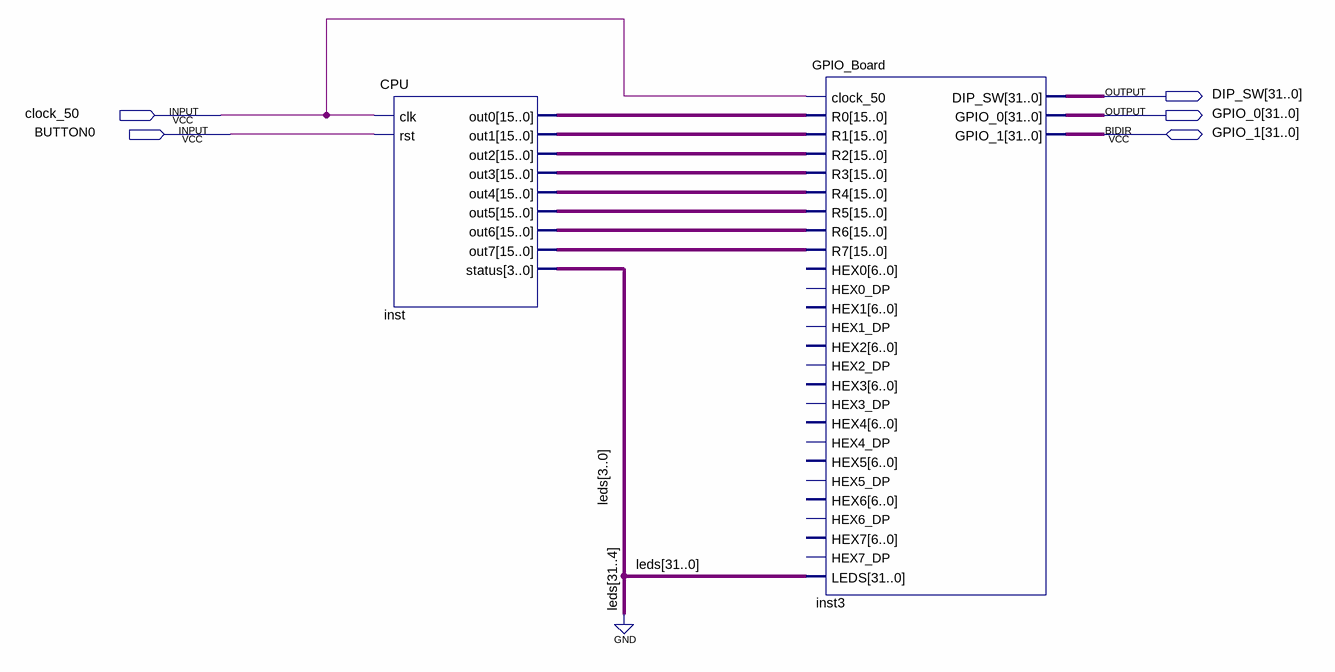
[diagram p0: schematic sheet]
// Quartus schematic NiceBoard.bdf as structural Verilog: 2 symbols, 5 pins
module NiceBoard (
  input  clock_50,
  input  BUTTON0,
  inout  [31:0] GPIO_1,
  output [31:0] DIP_SW,
  output [31:0] GPIO_0
);

  wire [3:0] leds;
  wire [15:0] inst_out0, inst_out1, inst_out2, inst_out3, inst_out4, inst_out5, inst_out6, inst_out7;

  CPU inst (
    .clk(clock_50), .rst(BUTTON0), .out0(inst_out0), .out1(inst_out1), .out2(inst_out2), .out3(inst_out3),
    .out4(inst_out4), .out5(inst_out5), .out6(inst_out6), .out7(inst_out7), .status(leds));
  GPIO_Board inst3 (
    .clock_50(clock_50), .R0(inst_out0), .R1(inst_out1), .R2(inst_out2), .R3(inst_out3), .R4(inst_out4),
    .R5(inst_out5), .R6(inst_out6), .R7(inst_out7), .LEDS({{28{1'b0}}, leds}), .DIP_SW(DIP_SW),
    .GPIO_0(GPIO_0), .GPIO_1(GPIO_1));  // open: HEX0, HEX0_DP, HEX1, HEX1_DP, HEX2, HEX2_DP, HEX3, HEX3_DP, HEX4, HEX4_DP, HEX5, HEX5_DP, HEX6, HEX6_DP, HEX7, HEX7_DP
endmodule
